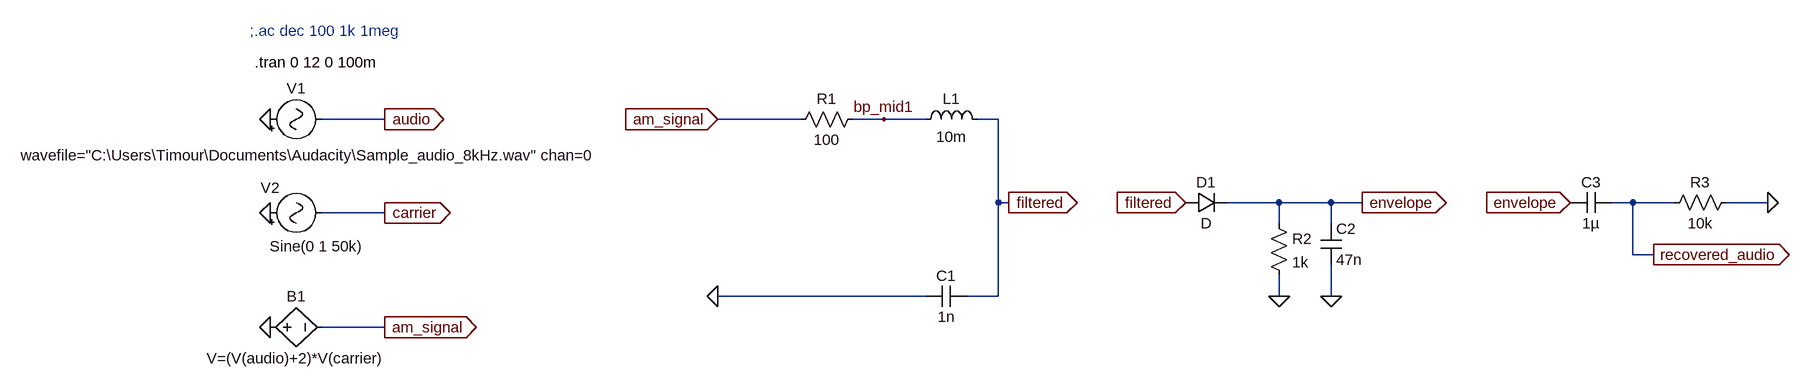
[diagram p0: schematic AM_radio_project.asc]
AM_radio_project.asc, the LTspice schematic file:
Version 4.1
SHEET 1 2588 680
WIRE 304 -32 208 -32
WIRE 944 -32 816 -32
WIRE 1072 -32 1024 -32
WIRE 1136 -32 1072 -32
WIRE 1248 -32 1216 -32
WIRE 1248 96 1248 -32
WIRE 1264 96 1248 96
WIRE 1680 96 1600 96
WIRE 1760 96 1680 96
WIRE 1808 96 1760 96
WIRE 2224 96 2192 96
WIRE 2288 96 2224 96
WIRE 2432 96 2368 96
WIRE 304 112 208 112
WIRE 1680 128 1680 96
WIRE 1760 128 1760 96
WIRE 2224 176 2224 96
WIRE 2256 176 2224 176
WIRE 1136 240 816 240
WIRE 1248 240 1248 96
WIRE 1248 240 1200 240
WIRE 1680 240 1680 208
WIRE 1760 240 1760 192
WIRE 304 288 208 288
FLAG 128 288 0
FLAG 304 288 am_signal
IOPIN 304 288 Out
FLAG 128 -32 0
FLAG 304 -32 audio
IOPIN 304 -32 Out
FLAG 304 112 carrier
IOPIN 304 112 Out
FLAG 128 112 0
FLAG 816 -32 am_signal
IOPIN 816 -32 In
FLAG 1072 -32 bp_mid1
FLAG 816 240 0
FLAG 1264 96 filtered
IOPIN 1264 96 Out
FLAG 1536 96 filtered
IOPIN 1536 96 In
FLAG 1680 240 0
FLAG 1760 240 0
FLAG 1808 96 envelope
IOPIN 1808 96 Out
FLAG 2128 96 envelope
IOPIN 2128 96 In
FLAG 2432 96 0
FLAG 2256 176 recovered_audio
IOPIN 2256 176 Out
SYMBOL Misc\\signal 112 -32 R270
WINDOW 0 32 56 VTop 2
WINDOW 3 -40 76 VBottom 2
SYMATTR InstName V1
SYMATTR Value wavefile="C:\Users\Timour\Documents\Audacity\Sample_audio_8kHz.wav" chan=0
SYMBOL Misc\\signal 112 112 R270
WINDOW 0 39 1 VRight 2
WINDOW 3 -51 15 VRight 2
WINDOW 123 0 0 Left 0
WINDOW 39 0 0 Left 0
SYMATTR InstName V2
SYMATTR Value Sine(0 1 50k)
SYMBOL bv 112 288 R270
WINDOW 0 32 56 VTop 2
WINDOW 3 -32 56 VBottom 2
SYMATTR InstName B1
SYMATTR Value V=(V(audio)+2)*V(carrier)
SYMBOL res 1040 -48 R90
WINDOW 0 0 56 VBottom 2
WINDOW 3 32 56 VTop 2
SYMATTR InstName R1
SYMATTR Value 100
SYMBOL ind 1120 -16 R270
WINDOW 0 32 56 VTop 2
WINDOW 3 5 56 VBottom 2
SYMATTR InstName L1
SYMATTR Value 10m
SYMATTR SpiceLine Rser=0
SYMBOL cap 1200 224 R90
WINDOW 0 0 32 VBottom 2
WINDOW 3 32 32 VTop 2
SYMATTR InstName C1
SYMATTR Value 1n
SYMBOL diode 1536 112 R270
WINDOW 0 32 32 VTop 2
WINDOW 3 0 32 VBottom 2
SYMATTR InstName D1
SYMBOL res 1664 112 R0
SYMATTR InstName R2
SYMATTR Value 1k
SYMBOL cap 1744 128 R0
SYMATTR InstName C2
SYMATTR Value 47n
SYMBOL cap 2128 112 R270
WINDOW 0 32 32 VTop 2
WINDOW 3 0 32 VBottom 2
SYMATTR InstName C3
SYMATTR Value 1µ
SYMBOL res 2272 112 R270
WINDOW 0 32 56 VTop 2
WINDOW 3 0 56 VBottom 2
SYMATTR InstName R3
SYMATTR Value 10k
TEXT 96 -168 Left 2 ;;.ac dec 100 1k 1meg
TEXT 104 -120 Left 2 !.tran 0 12 0 100m

The netlist it stands for:
* AM_radio_project.asc
V1 0 audio wavefile="C:\Users\Timour\Documents\Audacity\Sample_audio_8kHz.wav" chan=0
V2 0 carrier Sine(0 1 50k)
B1 0 am_signal V=(V(audio)+2)*V(carrier)
R1 bp_mid1 am_signal 100
L1 bp_mid1 filtered 10m Rser=0
C1 filtered 0 1n
D1 filtered envelope D
R2 envelope 0 1k
C2 envelope 0 47n
C3 envelope recovered_audio 1µ
R3 recovered_audio 0 10k
.model D D
.lib standard.dio
* ;.ac dec 100 1k 1meg
.tran 0 12 0 100m
.backanno
.end